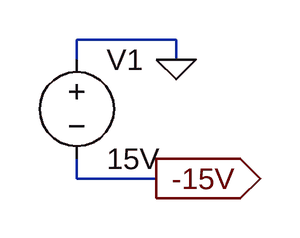
[diagram p0: schematic -15V.asc]
-15V.asc, the LTspice schematic file:
Version 4
SHEET 1 880 680
WIRE 272 112 192 112
WIRE 192 128 192 112
WIRE 272 128 272 112
WIRE 192 224 192 208
WIRE 256 224 192 224
FLAG 272 128 0
FLAG 256 224 -15V
IOPIN 256 224 Out
SYMBOL voltage 192 112 R0
WINDOW 123 0 0 Left 2
WINDOW 39 0 0 Left 2
SYMATTR InstName V1
SYMATTR Value 15V

The netlist it stands for:
* -15V.asc
V1 0 -15V 15V
.backanno
.end